# EAGLE design Carrier Board (EAGLE 8.4.0)

## Sheet 1 of 3: Sensors
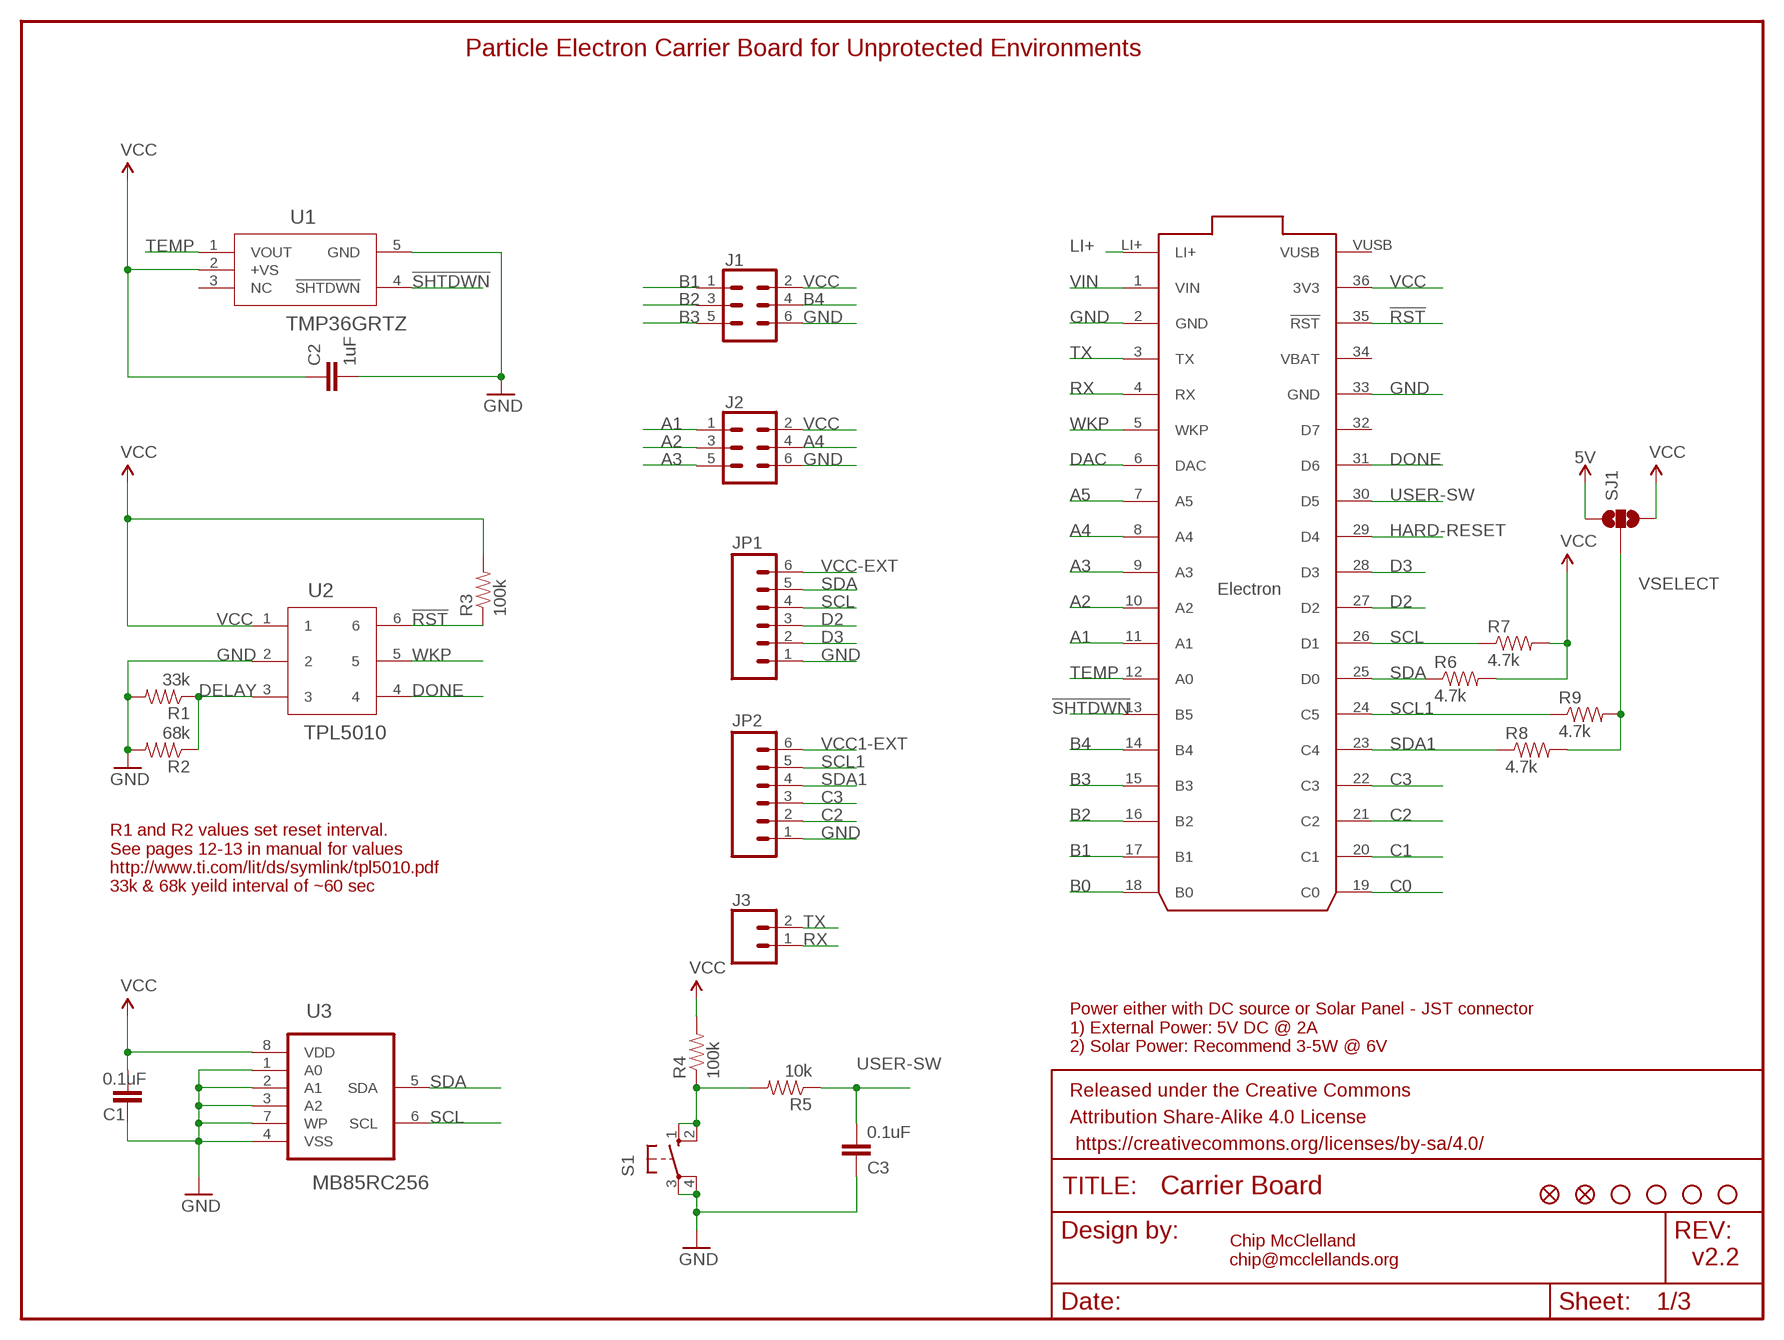
[diagram p0: schematic, sheet 1]

### Parts
C1  0.1uF  CAP0805  [0805]
C2  1uF  CAP0805  [0805]
C3  0.1uF  CAP0805  [0805]
FD1  FIDUCIALUFIDUCIAL  [FIDUCIAL-MICRO]
FD2  FIDUCIALUFIDUCIAL  [FIDUCIAL-MICRO]
FRAME1  FRAME-LETTER  [CREATIVE_COMMONS]
J1  CONN_03X22X3_SILK_MALE_PTH  [2X3]
J2  CONN_03X22X3_SILK_MALE_PTH  [2X3]
J3  CONN_02  [1X02]
JP1  M06LOCK  [1X06_LOCK]
JP2  M06LOCK  [1X06_LOCK]
JP3  STAND-OFF  [STAND-OFF]
JP4  STAND-OFF  [STAND-OFF]
JP5  STAND-OFF  [STAND-OFF]
JP6  STAND-OFF  [STAND-OFF]
R1  33k  RESISTOR0805-RES  [0805]
R2  68k  RESISTOR0805-RES  [0805]
R3  100k  RESISTOR0805-RES  [0805]
R4  100k  RESISTOR0805-RES  [0805]
R5  10k  RESISTOR0805-RES  [0805]
R6  4.7k  RESISTOR0805-RES  [0805]
R7  4.7k  RESISTOR0805-RES  [0805]
R8  4.7k  RESISTOR0805-RES  [0805]
R9  4.7k  RESISTOR0805-RES  [0805]
S1  10-XX  [B3F-10XX]
SJ1  SOLDERJUMPER_2WAYPASTE1&2  [SJ_3_PASTE1&2]
U1  TMP36GRTZ  TMP36GRTZ-REEL7  [RJ_5]
U2  TPL5010  [TSOT-23]
U3  MB85RC256  MB85RC128PNF-G-JNE1  [SOIC127P600X175-8N]
U4  Particle Electron  ELECTRON-PWR-PINS  [ELECTON-PWR-PINS]

### Nets
5V: SJ1.1 ; also sheet 3
!RST: R3.1 U2.6 U4.35(!RST)
!SHTDWN: U1.4(!SHTDWN) U4.13(B5)
A1: J2.1 U4.11(A1)
A2: J2.3 U4.10(A2)
A3: J2.5 U4.9(A3)
A4: J2.4 U4.8(A4)
A5: U4.7(A5)
B0: U4.18(B0)
B1: J1.1 U4.17(B1)
B2: J1.3 U4.16(B2)
B3: J1.5 U4.15(B3)
B4: J1.4 U4.14(B4)
C0: U4.19(C0)
C1: U4.20(C1)
C2: JP2.2 U4.21(C2) ; also sheet 3
C3: JP2.3 U4.22(C3) ; also sheet 3
D2: JP1.3 U4.27(D2) ; also sheet 3
D3: JP1.2 U4.28(D3) ; also sheet 3
DAC: U4.6(DAC)
DELAY: R1.1 R2.1 U2.3
DONE: U2.4 U4.31(D6)
GND: C1.2 C2.2 C3.2 J1.6 J2.6 JP1.1 JP2.1 R1.2 R2.2 S1.3(P) S1.4(P1) U1.5(GND) U2.2 U3.1(A0) U3.2(A1) U3.3(A2) U3.4(VSS) U3.7(WP) U4.2(GND) U4.33(GND) ; also sheet 2,3
HARD-RESET: U4.29(D4) ; also sheet 2
LI+: U4.LI+ ; also sheet 2
N$4: R4.1 R5.2 S1.1(S) S1.2(S1)
RX: J3.1 U4.4(RX)
SCL: JP1.4 R7.1 U3.6(SCL) U4.26(D1) ; also sheet 3
SCL1: JP2.5 R9.1 U4.24(C5) ; also sheet 3
SDA: JP1.5 R6.1 U3.5(SDA) U4.25(D0) ; also sheet 3
SDA1: JP2.4 R8.1 U4.23(C4) ; also sheet 3
TEMP: U1.1(VOUT) U4.12(A0)
TX: J3.2 U4.3(TX)
USER-SW: C3.1 R5.1 U4.30(D5)
VCC: C1.1 C2.1 J1.2 J2.2 R3.2 R4.2 R6.2 R7.2 SJ1.3 U1.2(+VS) U2.1 U3.8(VDD) U4.36(3V3) ; also sheet 3
VCC1-EXT: JP2.6 ; also sheet 3
VCC-EXT: JP1.6 ; also sheet 3
VIN: U4.1(VIN) ; also sheet 2
VSELECT: R8.2 R9.2 SJ1.2 ; also sheet 3
WKP: U2.5 U4.5(WKP)
Unconnected: U1.3(NC) U4.32(D7) U4.VUSB

### Notes on the sheet
- Particle Electron Carrier Board for Unprotected Environments
- R1 and R2 values set reset interval.
  See pages 12-13 in manual for values
  http://www.ti.com/lit/ds/symlink/tpl5010.pdf
  33k & 68k yeild interval of ~60 sec
- Power either with DC source or Solar Panel - JST connector
  1) External Power: 5V DC @ 2A 
  2) Solar Power: Recommend 3-5W @ 6V
- Chip McClelland
  chip@mcclellands.org
- v2.2

## Sheet 2 of 3: Power Control
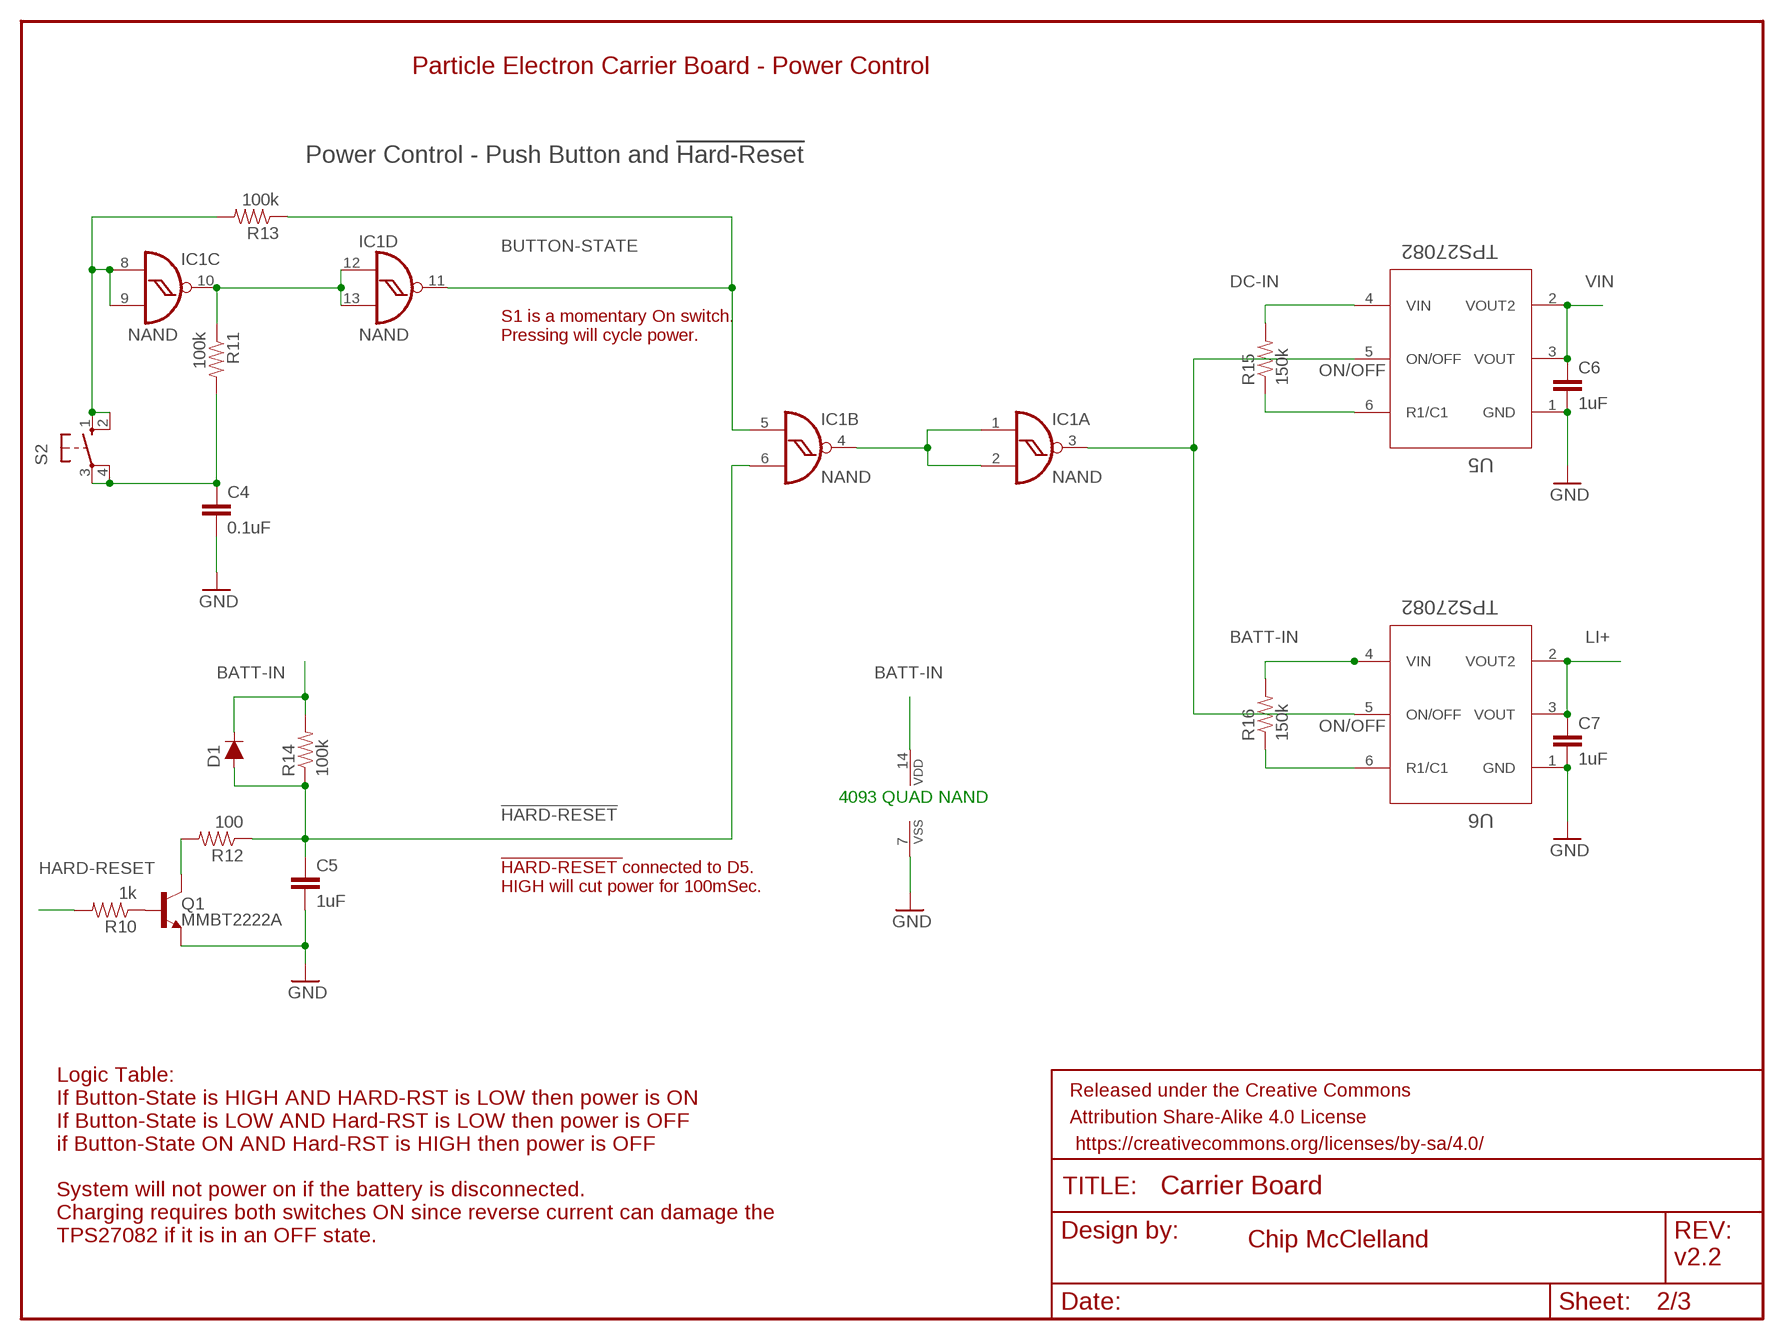
[diagram p1: schematic, sheet 2]

### Parts
C4  0.1uF  CAP0805  [0805]
C5  1uF  CAP0805  [0805]
C6  1uF  CAP0805  [0805]
C7  1uF  CAP0805  [0805]
D1  DIODE-BAS16J  [SOD-323]
FRAME2  FRAME-LETTER  [CREATIVE_COMMONS]
IC1  NAND  4093DT  [MC14093B-TSSOP14]
Q1  MMBT2222A  TRANS_NPN-MMBT2222AL  [SOT23-3]
R10  1k  RESISTOR0805-RES  [0805]
R11  100k  RESISTOR0805-RES  [0805]
R12  100  RESISTOR0805-RES  [0805]
R13  100k  RESISTOR0805-RES  [0805]
R14  100k  RESISTOR0805-RES  [0805]
R15  150k  RESISTOR0805-RES  [0805]
R16  150k  RESISTOR0805-RES  [0805]
S2  40-XX-ROUND  [B3F-40XX-ROUND]
U5  TPS27082  [TSOT-23]
U6  TPS27082  [TSOT-23]

### Nets
!HARD-RESET: C5.1 D1.A IC1.6(B:I1) R12.1 R14.1
BATT-IN: D1.C IC1.14(P:VDD) R14.2 R16.2 U6.4(VIN) ; also sheet 3
BUTTON-STATE: IC1.5(B:I0) IC1.11(D:O) R13.1
DC-IN: R15.2 U5.4(VIN) ; also sheet 3
GND: C4.2 C5.2 C6.2 C7.2 IC1.7(P:VSS) Q1.2(E) U5.1(GND) U6.1(GND) ; also sheet 1,3
HARD-RESET: R10.2 ; also sheet 1
LI+: C7.1 U6.2(VOUT2) U6.3(VOUT) ; also sheet 1
N$1: IC1.1(A:I0) IC1.2(A:I1) IC1.4(B:O)
N$14: IC1.10(C:O) IC1.12(D:I0) IC1.13(D:I1) R11.1
N$15: R15.1 U5.6(R1/C1)
N$16: Q1.1(B) R10.1
N$17: R16.1 U6.6(R1/C1)
N$19: Q1.3(C) R12.2
N$24: C4.1 R11.2 S2.3(P) S2.4(P1)
N$25: IC1.8(C:I0) IC1.9(C:I1) R13.2 S2.1(S) S2.2(S1)
ON/OFF: IC1.3(A:O) U5.5(ON/OFF) U6.5(ON/OFF)
VIN: C6.1 U5.2(VOUT2) U5.3(VOUT) ; also sheet 1

### Notes on the sheet
- Particle Electron Carrier Board - Power Control
- Power Control - Push Button and !Hard-Reset
- S1 is a momentary On switch.
  Pressing will cycle power.
- 4093 QUAD NAND
- !HARD-RESET !connected to D5. 
  HIGH will cut power for 100mSec.
- Chip McClelland
- Logic Table:
  If Button-State is HIGH AND HARD-RST is LOW then power is ON
  If Button-State is LOW AND Hard-RST is LOW then power is OFF
  if Button-State ON AND Hard-RST is HIGH then power is OFF
  
  System will not power on if the battery is disconnected.  
  Charging requires both switches ON since reverse current can damage the
  TPS27082 if it is in an OFF state.
- v2.2

## Sheet 3 of 3: Protection and 5V Boost
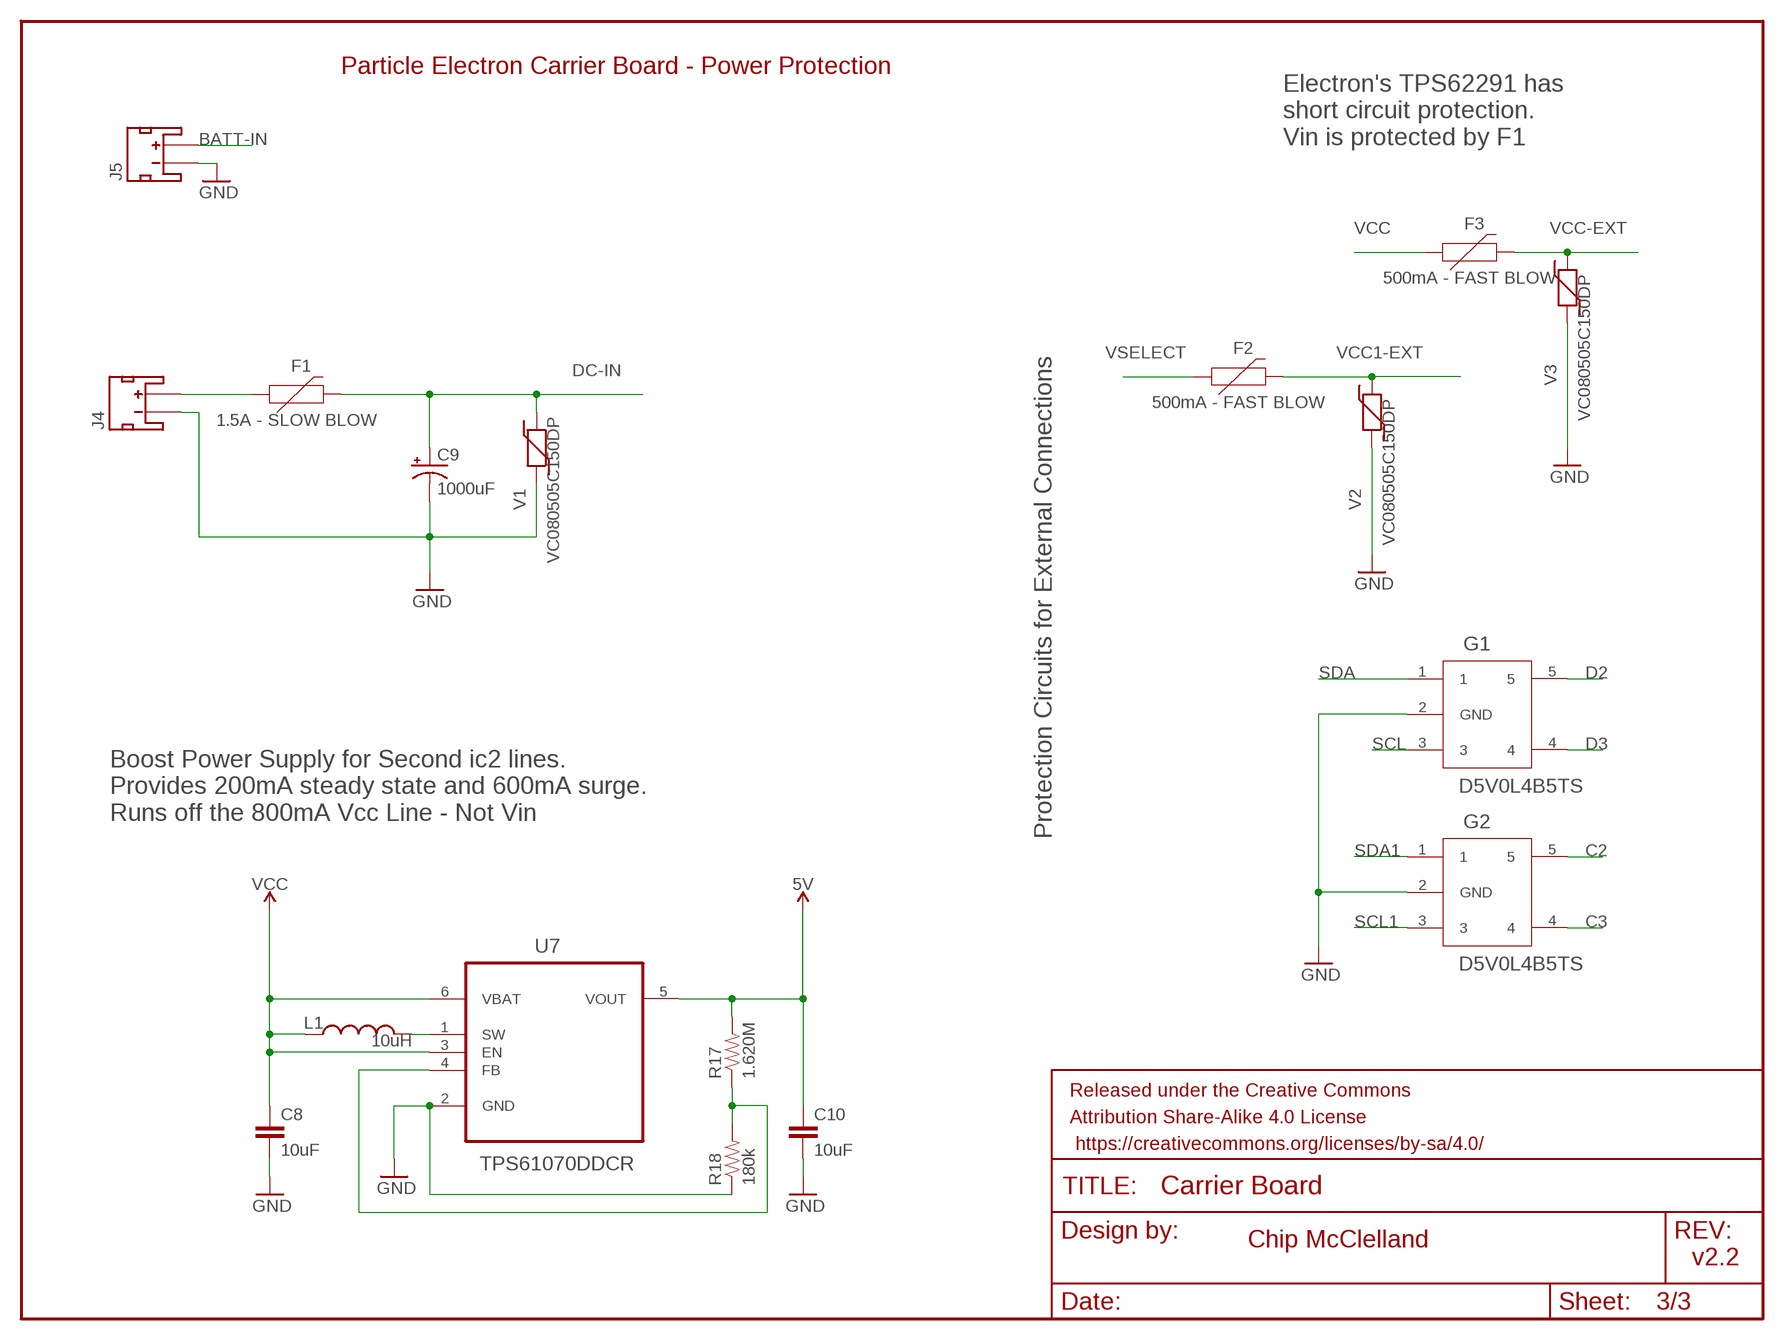
[diagram p2: schematic, sheet 3]

### Parts
C8  10uF  CAP0805  [0805]
C9  1000uF  CAP_POLG  [PANASONIC_G]
C10  10uF  CAP0805  [0805]
F1  1.5A - SLOW BLOW  PPTC_HALF-AMP  [1206]
F2  500mA - FAST BLOW  PPTC_HALF-AMP  [1206]
F3  500mA - FAST BLOW  PPTC_HALF-AMP  [1206]
FRAME3  FRAME-LETTER  [CREATIVE_COMMONS]
G1  D5V0L4B5TS  [SOT-23-5]
G2  D5V0L4B5TS  [SOT-23-5]
J4  5V @ 2A  JST_2MM_MALE  [JST-2-SMD]
J5  JST_2MM_MALE  [JST-2-SMD]
L1  10uH  INDUCTORSDR0403-560KL  [SDR0403]
R17  1.620M  RESISTOR0805-RES  [0805]
R18  180k  RESISTOR0805-RES  [0805]
U7  TPS61070DDCR  [SOT95P280X110-6N]
V1  VC080505C150DP  VARISTOR  [0805]
V2  VC080505C150DP  VARISTOR  [0805]
V3  VC080505C150DP  VARISTOR  [0805]

### Nets
5V: C10.1 R17.2 U7.5(VOUT) ; also sheet 1
BATT-IN: J5.2(+) ; also sheet 2
C2: G2.5 ; also sheet 1
C3: G2.4 ; also sheet 1
D2: G1.5 ; also sheet 1
D3: G1.4 ; also sheet 1
DC-IN: C9.+ F1.2 V1.2 ; also sheet 2
DC-IN-EXT: F1.1 J4.2(+)
GND: C8.2 C9.- C10.2 G1.2(GND) G2.2(GND) J4.1(-) J5.1(-) R18.1 U7.2(GND) V1.1 V2.1 V3.1 ; also sheet 1,2
N$2: R17.1 R18.2 U7.4(FB)
SCL: G1.3 ; also sheet 1
SCL1: G2.3 ; also sheet 1
SDA: G1.1 ; also sheet 1
SDA1: G2.1 ; also sheet 1
SW: L1.P$2 U7.1(SW)
VCC: C8.1 F3.1 L1.P$1 U7.3(EN) U7.6(VBAT) ; also sheet 1
VCC1-EXT: F2.2 V2.2 ; also sheet 1
VCC-EXT: F3.2 V3.2 ; also sheet 1
VSELECT: F2.1 ; also sheet 1
Unconnected: J4.NC1(PAD1) J4.NC2(PAD2) J5.NC1(PAD1) J5.NC2(PAD2)

### Notes on the sheet
- Particle Electron Carrier Board - Power Protection
- Electron's TPS62291 has 
  short circuit protection. 
  Vin is protected by F1
- Boost Power Supply for Second ic2 lines.
  Provides 200mA steady state and 600mA surge. 
  Runs off the 800mA Vcc Line - Not Vin
- Protection Circuits for External Connections
- Chip McClelland
- v2.2

## Power pins joined to a net without a drawn wire
VBAT: U4.34(VBAT)

## Library data of the parts
C1-C8 C10 = SparkFun-Capacitors:CAP: Capacitor Standard 0603 ceramic capacitor, and 0.1" leaded capacitor.
C9 = SparkFun-Capacitors:CAP_POL: Capacitor Polarized These are standard SMD and PTH capacitors. Normally 10uF, 47uF, and 100uF in electrolytic and tantalum varieties. Always verify the external diameter of the through hole cap, it varies with capacity, voltage, and manufacturer. The EIA devices should be standard.
D1 = SparkFun-DiscreteSemi:DIODE: Diode These are standard reverse protection diodes and small signal diodes. SparkFun Products: SparkFun SparkPunk Sound Kit <https://www.sparkfun.com/products/11177> SparkFun ESP8266 Thing <https://www.sparkfun.com/products/13231>; PROD_ID: DIO-09646; VALUE: 250mA/100V
F1-F3 = SparkFun-Fuses:PPTC: Resettable Fuse PPTC Resettable Fuse. Really a sort of resistor with a polymeric positive temperature coefficient whose resistance increases dramatically with an increase in temperature. When heated by the power passing through the resistance rises causing the current to be limited, protecting the circuit. This is achieved by the transition of the polymer from a crystalline to an amorphous state where the conductive carbon separates breaking the conductive pathways found in the cool crystalline structure. When a PPTC cools back down it resumes conducting letting the circuit turn back on. SparkFun Products: SparkFun RedBoard - Programmed with Arduino <https://www.sparkfun.com/products/12757> Pro Micro - 5V/16MHz <https://www.sparkfun.com/products/12640> Arduino Pro 328 - 5V/16MHz <https://www.sparkfun.com/products/10915> MP3 Trigger <https://www.sparkfun.com/products/13720>; PROD_ID: RES-08585; VALUE: 6V/0.5A
FD1 FD2 = SparkFun-Aesthetics:FIDUCIAL: Fiducial Alignment Points Point-of-reference for pick-and-place machines and other optical instruments.
FRAME1-FRAME3 = SparkFun-Aesthetics:FRAME-LETTER: Schematic Frame - Letter Standard 8.5x11 US Letter frame
G1 G2 = Custom Components:D5V0L4B5TS: 4 CHANNEL LOW CAPACITANCE BI-DIRECTIONAL TVS ARRAY
IC1 = adafruit:4093: Quad 2-input NAND schmitt trigger
J1 J2 = SparkFun-Connectors:CONN_03X2: Multi connection point. Often used as Generic Header-pin footprint for 0.1 inch spaced/style header connections You can populate with any combo of single row headers, but if you'd like an exact match, check these: Header - 2x3 (Male, 0.1") <https://www.sparkfun.com/products/12807> (PRT-12807) Header - 2x3 (Female, 0.1") <https://www.sparkfun.com/products/13010> (PRT-13010) 2x3 Pin Shrouded Header <https://www.sparkfun.com/products/10877> (PRT-10877) On any of the 0.1 inch spaced packages, you can populate with these: Break Away Headers - Straight <https://www.sparkfun.com/products/116> (PRT-00116) Break Away Male Headers - Right Angle <https://www.sparkfun.com/products/553> (PRT-00553) Female Headers <https://www.sparkfun.com/products/115> (PRT-00115) Break Away Headers - Machine Pin <https://www.sparkfun.com/products/117> (PRT-00117) Break Away Female Headers - Swiss Machine Pin <https://www.sparkfun.com/products/743> (PRT-00743) Special note: the shrouded connector mates well with our 3x2 ribbon cables: Ribbon Crimp Connector - 6-pin (2x3, Female) <https://www.sparkfun.com/products/10651> (PRT-10651) Ribbon Cable - 6 wire (15ft) <https://www.sparkfun.com/products/10646> (PRT-10646); PROD_ID: CONN-09701
J3 = SparkFun-Connectors:CONN_02: Multi connection point. Often used as Generic Header-pin footprint for 0.1 inch spaced/style header connections On any of the 0.1 inch spaced packages, you can populate with these: Break Away Headers - Straight <https://www.sparkfun.com/products/116> (PRT-00116) Break Away Male Headers - Right Angle <https://www.sparkfun.com/products/553> (PRT-00553) Female Headers <https://www.sparkfun.com/products/115> (PRT-00115) Break Away Headers - Machine Pin <https://www.sparkfun.com/products/117> (PRT-00117) Break Away Female Headers - Swiss Machine Pin <https://www.sparkfun.com/products/743> (PRT-00743) For SCREWTERMINALS and SPRING TERMINALS visit here: Screw Terimnals on SparkFun.com <https://www.sparkfun.com/search/results?term=Screw+Terminals> (5mm/3.5mm/2.54mm spacing) This device is also useful as a general connection point to wire up your design to another part of your project. Our various solder wires solder well into these plated through hole pads. Hook-Up Wire - Assortment (Stranded, 22 AWG) <https://www.sparkfun.com/products/11375> (PRT-11375) Hook-Up Wire - Assortment (Solid Core, 22 AWG) <https://www.sparkfun.com/products/11367> (PRT-11367) View the entire wire category on our website here <https://www.sparkfun.com/categories/141> Special notes: Molex polarized connector foot print use with: PRT-08233 with associated crimp pins and housings. 2.54_SCREWTERM for use with PRT-10571. 3.5mm Screw Terminal footprints for PRT-08084 5mm Screw Terminal footprints for use with PRT-08432
J4 J5 = SparkFun-Connectors:JST_2MM_MALE: JST 2MM MALE RA CONNECTOR Two pin, compact surface mount connector. Commonly used as a battery input connection point. We really like the solid locking feeling and high current rating on these small connectors. We use these all the time as battery connectors. Mates to single-cell LiPo batteries. Here is the connector we sell at SparkFun: JST Right Angle Connector - White <https://www.sparkfun.com/products/8612> (PRT-08612) Datasheet <http://www.sparkfun.com/datasheets/Prototyping/Connectors/JST-Horizontal.pdf> It was used on these SparkFun products: SparkFun MOSFET Power Controller <https://www.sparkfun.com/products/11214> (PRT-11214) SparkFun Battery Babysitter - LiPo Battery Manager <https://www.sparkfun.com/products/13777> (PRT-13777) And many, many others that required a lipo battery connection.; PROD_ID: CONN-11443; SF_ID: PRT-08612
JP1 JP2 = SparkFun-Connectors:M06: Header 6 Standard 6-pin 0.1" header. Use with straight break away headers (SKU : PRT-00116), right angle break away headers (PRT-00553), swiss pins (PRT-00743), machine pins (PRT-00117), and female headers (PRT-00115). Molex polarized connector foot print use with SKU : PRT-08094 with associated crimp pins and housings. NOTES ON THE VARIANTS LOCK and LOCK_LONGPADS... This footprint was designed to help hold the alignment of a through-hole component (i.e. 6-pin header) while soldering it into place. You may notice that each hole has been shifted either up or down by 0.005 of an inch from it's more standard position (which is a perfectly straight line). This slight alteration caused the pins (the squares in the middle) to touch the edges of the holes. Because they are alternating, it causes a "brace" to hold the component in place. 0.005 has proven to be the perfect amount of "off-center" position when using our standard breakaway headers. Although looks a little odd when you look at the bare footprint, once you have a header in there, the alteration is very hard to notice. Also,if you push a header all the way into place, it is covered up entirely on the bottom side. This idea of altering the position of holes to aid alignment will be further integrated into the Sparkfun Library for other footprints. It can help hold any component with 3 or more connection pins.
JP3-JP6 = SparkFun:STAND-OFF: Stand Off This is the mechanical footprint for a #4 phillips button head screw. Use the keepout ring to avoid running the screw head into surrounding components. SKU : PRT-00447
L1 = SparkFun-Passives:INDUCTOR: Inductors Basic Inductor/Choke - 0603 and 1206. Footprints are not proven and vary greatly between part numbers. SRN6045- 33uH, 20% 1.4A SDR0403-560KL - 56uH, 10%, 500mA RMS/740mA peak; DIST: DIGIKEY; DIST_ID: SDR0403-560KLCT-ND; VALUE: 56uH
Q1 = SparkFun-DiscreteSemi:TRANS_NPN: NPN transistor Current controlled devices typically used to amplify current or used as a switch. BC547 - COM-08928 <http://www.sparkfun.com/products/8928> (TO-92 45V 100mA) (1.Collector 2.Base 3.Emitter) 2N3904 - COM-00521 <http://www.sparkfun.com/products/521> (TO-92 40V 200mA) (1.Emitter 2.Base 3.Collector) P2N2222A - COM-12852 <http://www.sparkfun.com/products/12852> (TO-92 40V 600mA) (1.Collector 2.Base 3.Emitter); PROD_ID: TRANS-08049; VALUE: 600mA/40V
R1-R18 = SparkFun-Passives:RESISTOR: Resistor Basic schematic elements and footprints for 0603, 1206, and PTH resistors.
S1 = switch-omron:10-XX: OMRON SWITCH
S2 = adafruit:40-XX: OMRON SWITCH
SJ1 = SparkFun-Passives:SOLDERJUMPER_2WAY: Solder Jumper 2 way solder jumper
U1 = TMP36:TMP36GRTZ-REEL7; MANUFACTURER_PART_NUMBER: TMP36GRTZREEL7; VENDOR: Analog Devices Inc
U2 = Custom Components:TPL5010
U3 = Fujitsu_By_element14_Batch_1:MB85RC128PNF-G-JNE1: Memory FRAM; MPN: MB85RC128PNF-G-JNE1; OC_FARNELL: 1831995; OC_NEWARK: 93R5161; PACKAGE: SO-8; SUPPLIER: FUJITSU
U4 = Particle-Devices:ELECTRON-PWR-PINS: This is a Electron pinout with the two power pins populated
U5 U6 = Custom Components:TPS27082: TI TPS27082 Single High-Side On-Off Switch
U7 = Texas Instruments_By_element14_Batch_1:TPS61070DDCR: SYNCHRONOUS BOOST CONVERTER; MPN: TPS61070DDCR; OC_FARNELL: 1461062; OC_NEWARK: 64M3125; PACKAGE: SOT-23-6; SUPPLIER: Texas Instruments
V1-V3 = Custom Components:VARISTOR

## Net classes
0 default: width 0.203 mm, drill 0.33 mm

## Board
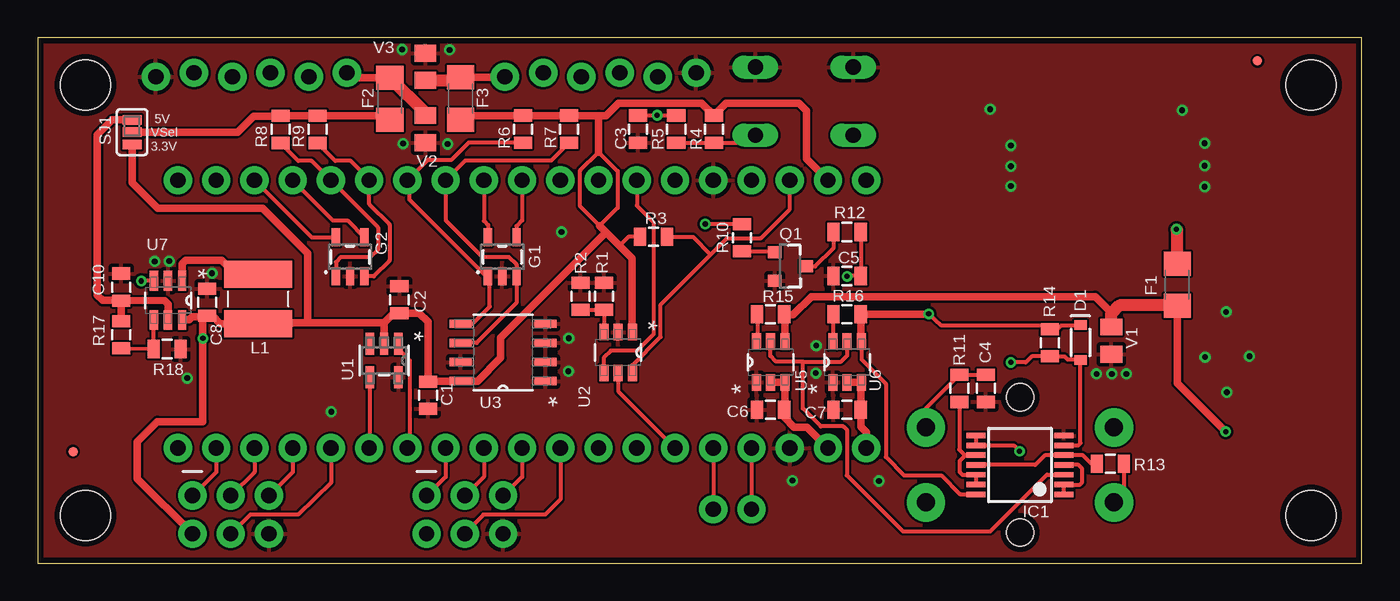
[diagram p3: board, top side]
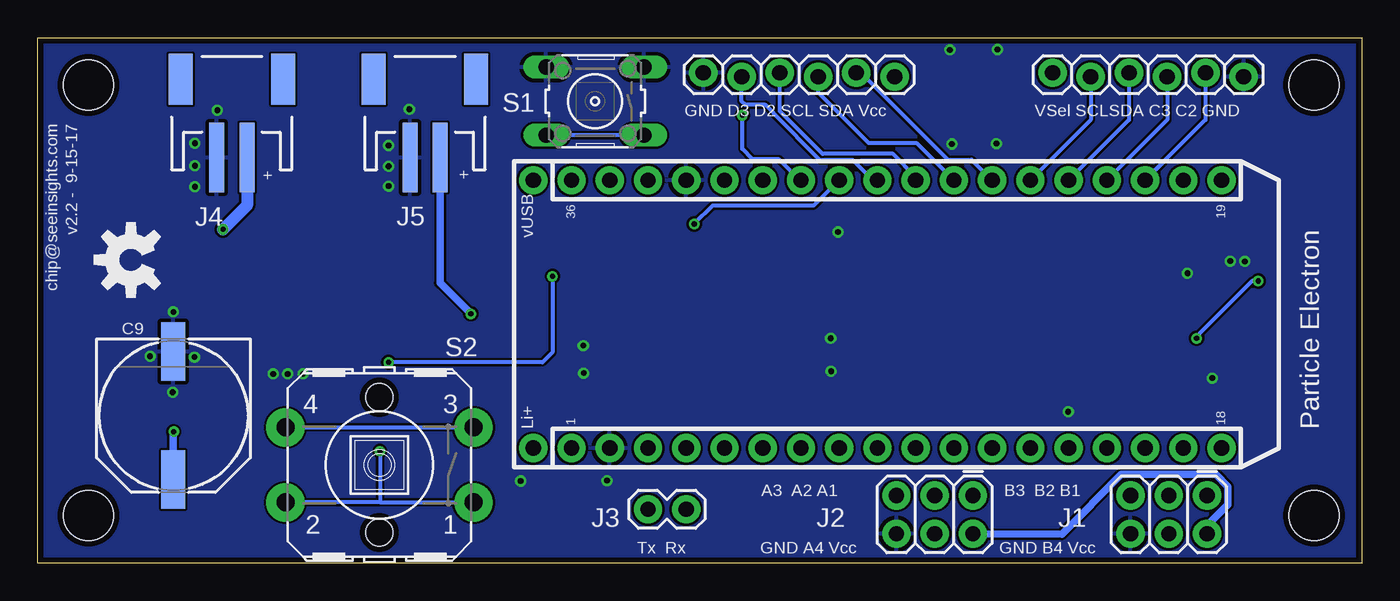
[diagram p4: board, bottom side, seen from below]

Size 87.96 x 34.9 mm. Coordinates in mm from the lower left corner, seen from the top.
Outline: 0,0 87.96,0 87.96,34.9 0,34.9 0,0
Copper layers (1*16): Top 0.0356mm / dielectric 1.5011mm / Bottom 0.0356mm
Design rules "LaenPCBOrder": minimum track width 6mil, minimum drill 13mil, track to track 6mil, track to pad 6mil, pad to pad 6mil, via to via 6mil, smd to smd 6mil, copper to edge 15mil, drill to drill 6mil, minimum pad ring 7mil, minimum via ring 7mil, stop-mask expansion 3mil, vias tented up to drill 0mil, thermal gap 10mil

### Footprints (pad centres in the part's own frame; a part is rotated, then mirrored left to right if it is on the bottom)
0805 = smd 0.8 x 1.2: 1 -0.9,0; 2 0.9,0
PANASONIC_G = smd 3.9 x 1.6: + 4.25,0; - -4.25,0
SOD-323 = smd 0.63 x 0.83: A 1.15,0; C -1.15,0
1206 = smd 1.6 x 1.8: 1 -1.4,0; 2 1.4,0
FIDUCIAL-MICRO = smd 0.635 x 0.635: 1 0,0
SOT-23-5 = smd 0.55 x 1.2: 1 -0.95,-1.3; 2 0,-1.3; 3 0.95,-1.3; 4 0.95,1.3; 5 -0.95,1.3
MC14093B-TSSOP14 = smd 0.36 x 1.26: 1 -1.95,-2.925; 2 -1.3,-2.925; 3 -0.65,-2.925; 4 0,-2.925; 5 0.65,-2.925; 6 1.3,-2.925; 7 1.95,-2.925; 8 1.95,2.925; 9 1.3,2.925; 10 0.65,2.925; 11 0,2.925; 12 -0.65,2.925; 13 -1.3,2.925; 14 -1.95,2.925
2X3 = drill 1.016 pad 1.88: 1 0,0; 2 0,2.54; 3 2.54,0; 4 2.54,2.54; 5 5.08,0; 6 5.08,2.54
1X02 = drill 1.016 pad 1.88: 1 0,0; 2 2.54,0
JST-2-SMD = smd 1 x 4.6: 1 -1,-3.7; 2 1,-3.7 | smd 1.6 x 3.4: NC1 -3.4,1.5; NC2 3.4,1.5
1X06_LOCK = drill 1.016 pad 1.88: 1 0,0; 2 2.54,-0.254; 3 5.08,0; 4 7.62,-0.254; 5 10.16,0; 6 12.7,-0.254
STAND-OFF = hole 3.302: 0,0
SDR0403 = smd 1.8 x 4.5: P$1 -1.65,0; P$2 1.65,0
SOT23-3 = smd 0.8 x 0.9: 1 -0.95,-1; 2 0.95,-1; 3 0,1.1
B3F-10XX = drill 1.016 long: 1 -3.251,2.261; 2 3.251,2.261; 3 -3.251,-2.261; 4 3.251,-2.261
B3F-40XX-ROUND = drill 1.194 pad 2.54: 1 -6.248,2.489; 2 6.248,2.489; 3 -6.248,-2.489; 4 6.248,-2.489 | hole 1.803: 0,-4.496; 0,4.496
SJ_3_PASTE1&2 = smd 0.635 x 1.27: 1 -0.813,0; 2 0,0; 3 0.813,0
RJ_5 = smd 1.473 x 0.559: 1 -1.118,0.95; 2 -1.118,0; 3 -1.118,-0.95; 4 1.118,-0.95; 5 1.118,0.95
TSOT-23 = smd 1.1 x 0.6: 1 -1.35,0.95; 2 -1.35,0; 3 -1.35,-0.94; 4 1.35,-0.95; 5 1.35,0; 6 1.35,0.95
SOIC127P600X175-8N = smd 1.473 x 0.559: 1 -2.819,1.905; 2 -2.819,0.635; 3 -2.819,-0.635; 4 -2.819,-1.905; 5 2.819,-1.905; 6 2.819,-0.635; 7 2.819,0.635; 8 2.819,1.905
ELECTON-PWR-PINS = drill 1.016 pad 1.88: 1 2.54,46.99; 2 2.54,44.45; 3 2.54,41.91; 4 2.54,39.37; 5 2.54,36.83; 6 2.54,34.29; 7 2.54,31.75; 8 2.54,29.21; 9 2.54,26.67; 10 2.54,24.13; 11 2.54,21.59; 12 2.54,19.05; 13 2.54,16.51; 14 2.54,13.97; 15 2.54,11.43; 16 2.54,8.89; 17 2.54,6.35; 18 2.54,3.81; 19 20.32,3.81; 20 20.32,6.35; 21 20.32,8.89; 22 20.32,11.43; 23 20.32,13.97; 24 20.32,16.51; 25 20.32,19.05; 26 20.32,21.59; 27 20.32,24.13; 28 20.32,26.67; 29 20.32,29.21; 30 20.32,31.75; 31 20.32,34.29; 32 20.32,36.83; 33 20.32,39.37; 34 20.32,41.91; 35 20.32,44.45; 36 20.32,46.99; LI+ 2.54,49.53; VUSB 20.32,49.53
SOT95P280X110-6N = smd 1.321 x 0.559: 1 -1.295,0.94; 2 -1.295,0; 3 -1.295,-0.94; 4 1.295,-0.94; 5 1.295,0; 6 1.295,0.94
0805' = smd 1.118 x 1.448: 1 -0.902,0; 2 0.902,0

### Placement (x,y rotation side)
C1  25.93,11.15 270 top
C2  24.03,17.5 90 top
C3  39.88,28.83 270 top
C4  62.99,11.61 270 top
C5  53.77,19.08 180 top
C6  48.69,10.19 180 top
C7  53.77,10.19 180 top
C8  11.25,17.32 90 top
C9  78.94,9.8 270 bottom
C10  5.56,18.34 90 top
D1  69.27,14.66 270 top
F1  75.69,18.49 270 top
F2  23.39,30.84 90 top
F3  28.09,30.86 90 top
FD1  81.03,33.35 0 top
FD2  2.36,7.42 0 top
FRAME1  0.03,-11.81 0 top  (outside the outline)
FRAME2  0.03,-20.29 0 top  (outside the outline)
FRAME3  0.03,-28.78 0 top  (outside the outline)
G1  30.86,20.35 0 top
G2  20.75,20.35 0 top
IC1  65.25,6.53 90 top
J1  10.29,4.5 180 bottom
J2  25.83,4.5 180 bottom
J3  44.88,3.58 180 bottom
J4  75.06,30.63 0 bottom
J5  62.23,30.63 0 bottom
JP1  43.74,32.56 0 bottom
JP2  7.85,32.31 180 bottom
JP3  84.58,31.75 0 top
JP4  84.58,3.17 90 top
JP5  3.17,31.75 0 top
JP6  3.17,3.17 0 top
L1  14.66,17.55 90 top
Q1  49.96,19.71 270 top
R1  37.62,17.73 90 top
R2  36.07,17.73 90 top
R3  40.92,21.67 180 top
R4  44.93,28.83 90 top
R5  42.42,28.83 270 top
R6  32.26,28.83 90 top
R7  35.31,28.83 90 top
R8  16.13,28.8 90 top
R9  18.59,28.8 90 top
R10  46.79,21.62 90 top
R11  61.21,11.61 90 top
R12  53.77,22 180 top
R13  71.25,6.6 0 top
R14  67.23,14.63 90 top
R15  48.69,16.54 0 top
R16  53.77,16.54 0 top
R17  5.56,15.16 90 top
R18  8.61,14.22 180 top
S1  50.93,30.68 180 bottom
S2  65.25,6.53 180 bottom
SJ1  6.27,28.63 270 top
U1  23.01,13.46 270 top
U2  38.56,14 270 top
U3  30.91,14 180 top
U4  5.51,5.11 90 bottom
U5  48.69,13.36 90 top
U6  53.77,13.36 90 top
U7  8.66,17.45 270 top
U$2  [OSHW-LOGO-M]  81.76,20.14 90 bottom
V1  VC080505C150DP  [0805']  71.32,14.78 90 top
V2  VC080505C150DP  [0805']  25.76,28.83 90 top
V3  VC080505C150DP  [0805']  25.76,32.97 270 top

### Tracks (layer width: path | path; a pad name or v marks a point on that pad's centre or on a via)
5V
  Top 0.508: U7.5 8.66,17.2 8.43,17.42 5.57,17.45 | 5.57,17.45 C10.1 R17.2 | SJ1.1 4.95,29.44 3.96,28.45 3.96,17.8 4.32,17.45 5.55,17.48 5.57,17.45
!HARD-RESET  (via drill 0.33)
  Top 0.254: R12.1 C5.1 53.77,19.07 v53.77,19.05 | v64.64,13.34 65.63,13.34 66.03,13.73 R14.1 | 67.22,13.72 R14.1 | R14.1 68.21,13.73 68.43,13.51 D1.A 69.27,7.98 69.12,7.83 IC1.6
  Bottom 0.254: v53.77,19.05 53.77,14 54.43,13.34 v64.64,13.34
!RST
  Top 0.254: U4.35 49.96,23.52 48.03,21.59 45.8,21.59 44.7,20.49 | U2.6 39.51,13.16 41.38,15.03 41.38,17.17 44.7,20.49 | R3.1 43.52,21.67 44.7,20.49
!SHTDWN
  Top 0.254: U1.4 22.06,7.69 U4.13
A1
  Top 0.254: U4.11 27.1,5.74 J2.1
A2
  Top 0.254: U4.10 29.64,5.74 J2.3
A3
  Top 0.254: U4.9 32.18,5.74 J2.5
A4
  Top 0.254: U4.8 34.72,4.24 33.71,3.23 29.62,3.23 J2.4
B1
  Top 0.254: U4.17 11.86,6.04 J1.1
B2
  Top 0.254: U4.16 14.4,6.04 J1.3
B3
  Top 0.254: U4.15 16.94,6.04 J1.5
B4
  Top 0.254: U4.14 19.48,5.36 17.3,3.23 14.12,3.23 J1.4
BATT-IN  (via drill 0.35)
  Top 0.254: U6.4 54.66,14.78 | 59.21,16.54 59.99,15.81 66.96,15.81 R14.2 67.73,15.53 68,15.8 69.26,15.8 D1.C | 54.67,14.76 54.74,14.7 54.74,13.51 56.34,11.91 56.34,7.06 57.56,5.84 60.02,5.84 61.27,4.6 62.31,4.6 IC1.14
  Top 0.508: U6.4 54.67,14.76 R16.2 59.21,16.54 v59.18,16.56
  Bottom 0.508: J5.2 61.23,18.61 v59.18,16.56
BUTTON-STATE
  Top 0.254: IC1.11 66.27,6.53 66.9,7.16 68.16,7.16 | 68.16,7.16 IC1.5 | R13.1 70,6.6 69.44,7.16 68.16,7.16
C2
  Top 0.254: 19.68,21.87 G2.5 18.21,21.64 14.43,25.43 U4.21
  Bottom 0.254: 14.3,25.53 13.13,26.7 | 14.3,25.53 U4.21 | JP2.2 10.39,29.44 14.3,25.53
C3
  Top 0.254: 21.7,21.96 G2.4 20.59,22.76 19.61,22.76 U4.22
  Bottom 0.254: 16.68,25.69 15.7,26.67 | 16.68,25.69 U4.22 | JP2.3 12.93,29.44 16.68,25.69
D2
  Top 0.254: U4.27 29.64,22.73 29.92,22.45 G1.5
  Bottom 0.254: 29.67,25.43 U4.27 29.64,25.68 31.14,27.18 35.81,27.18 38.66,30.02 JP1.3
D3
  Top 0.254: U4.28 32.18,22.76 31.8,22.38 G1.4
  Bottom 0.254: U4.28 32.46,25.43 33.81,26.77 35.98,26.77 39.06,29.85 39.06,29.87 39.62,30.43 40.95,30.43 41.2,30.68 JP1.2
DC-IN  (via drill 0.35)
  Top 0.254: 49.63,14.78 U5.4 | 49.63,16.38 R15.2
  Top 0.508: U5.4 49.64,16.48 | 49.64,16.48 R15.2 | 49.64,16.48 50.17,16.48 51.38,17.7 70.26,17.7 71.35,16.61 | F1.2 75.69,11.96 v78.92,8.74 78.94,8.71
  Top 0.813: F1.2 75.66,17.12 71.86,17.12 71.35,16.61 71.3,16.56 71.3,15.71 V1.2
  Bottom 0.508: C9.+ 78.94,8.71 v78.92,8.74
DC-IN-EXT  (via drill 0.35)
  Top 0.813: F1.1 75.69,22.12 v75.64,22.17
  Bottom 0.813: J4.2 74.06,23.76 v75.64,22.17 | v75.64,22.17 75.67,22.15 v75.64,22.17
DELAY
  Top 0.254: U2.3 R1.1 R2.1
DONE
  Top 0.254: U4.31 39.8,23.75 40.92,22.63 40.92,15.21 39.83,14.12 38.08,14.12 37.59,13.64 37.59,12.66 U2.4
GND  (via drill 0.38)
  other vias: 19.51,10.06 35.28,14.94 35.26,12.75 51.69,12.62 64.64,27.74 63.27,30.15 64.64,26.37 64.64,25.04 76.02,30.07 77.52,27.89 77.52,26.39 77.52,24.99 34.8,22 55.88,5.46 78.94,16.69 78.99,11.35 80.49,13.74 77.55,13.69 51.71,14.45 27.36,34.09 24.28,27.86 27.23,27.84 72.31,12.57 70.33,12.57 71.35,12.57 50.14,5.49 11.58,19.25 9.93,12.29 8.74,20.07 7.77,20.04 24.21,34.11
  pour Top (rank 2): -3.78,37.29 90.42,37.47 90.37,-2.01 -3.78,-2.18
  pour Bottom: -4.39,38.3 91.31,38.15 91.14,-2.41 -4.22,-2.39
HARD-RESET  (via drill 0.35)
  Top 0.254: v44.35,22.53 46.77,22.53 R10.2
  Bottom 0.254: U4.29 34.75,25.43 36.42,23.75 43.13,23.75 v44.35,22.53
LI+
  Top 0.254: U6.2 53.98,12.04 | 54.66,12.04 U6.3 54.66,11.81 | 54.66,10.21 C7.1
  Top 0.508: U4.LI+ 55.04,8.71 54.69,9.07 54.69,10.19 54.66,10.21 | C7.1 54.67,11.97 U6.3 U6.2
N$1
  Top 0.254: IC1.1 IC1.2 69.24,5.23 69.39,5.38 69.39,6.27 69.14,6.53 IC1.4
N$2
  Top 0.254: R17.1 7.7,14.24 R18.2 U7.4
N$4
  Top 0.254: S1.1 47.18,27.93 R4.1 R5.2
  Bottom 0.254: S1.1 S1.2
N$14
  Top 0.254: 62.35,5.21 IC1.13 IC1.12 62.32,5.87 61.44,5.87 61.24,6.07 61.24,6.78 61.63,7.18 IC1.10 62.32,7.19 61.57,7.19 61.21,7.54 R11.1
N$15
  Top 0.254: U5.6 47.8,14.78 47.8,16.38 R15.1
N$16
  Top 0.254: Q1.1 48.95,20.73 46.89,20.73 R10.1
N$17
  Top 0.254: U6.6 52.83,14.78 52.83,16.38 R16.1
N$19
  Top 0.254: 51.23,19.81 Q1.3 51.64,19.71 52.88,20.95 52.88,21.98 R12.2
N$24
  Top 0.254: S2.3 59,10.3 R11.2 C4.1
  Bottom 0.254: S2.4 S2.3
N$25  (via drill 0.33)
  Top 0.254: IC1.8 IC1.9 64.84,7.83 v65.23,7.44 65.28,7.39 | R13.2 72.15,4.68 S2.2
  Bottom 0.254: 65.18,4.04 S2.2 | 65.18,4.04 S2.1 | v65.23,7.44 65.23,4.08 65.18,4.04
ON/OFF
  Top 0.254: IC1.3 67.04,5.88 63.27,2.11 57.48,2.11 53.75,5.84 53.75,8.87 53.52,9.09 52.02,9.09 50.83,10.29 50.83,13.39 | U6.5 53.77,13.79 53.37,13.39 50.83,13.39 | 50.83,13.39 49.05,13.39 48.67,13.77 48.67,14.69 U5.5 | 50.83,13.39
RX
  Top 0.254: U4.4 J3.1
SCL
  Top 0.254: U3.6 29.16,14.63 31.81,17.28 G1.3 31.8,18.9 31.8,19.84 31.29,20.34 29.52,20.34 27.1,22.76 U4.26 28.42,26.75 34.12,26.75 R7.1
  Bottom 0.254: JP1.4 36.12,31.27 32.77,27.91 29.59,27.91 U4.26
SCL1
  Top 0.254: 21.74,19.13 G2.3 22.33,19.05 23.37,20.09 23.37,22.5 22.02,23.85 U4.24 22.02,25.5 20.8,26.72 19.78,26.72 R9.1
  Bottom 0.254: JP2.5 18.01,29.44 U4.24
SDA
  Top 0.254: U3.5 28.88,15.9 30.02,17.04 30.02,18.93 G1.1 29.8,19.05 24.69,24.16 24.69,25.3 U4.25 25.94,26.81 25.95,26.8 27.51,26.8 28.65,27.94 32.25,27.94 R6.1
  Bottom 0.254: JP1.5 33.27,32.56 27.51,26.8 25.93,26.8 U4.25
SDA1
  Top 0.254: G2.1 19.81,19.05 19.81,19.99 20.14,20.32 22.1,20.32 22.61,20.83 22.61,22.3 U4.23 18.19,26.72 17.31,26.72 R8.1
  Bottom 0.254: JP2.4 15.47,29.44 U4.23
SW
  Top 0.508: 13.14,19.2 L1.P$2 | 13.14,19.2 12.9,19.2 | 13.14,19.2 12.22,20.12 9.83,20.12 9.6,19.89 U7.1
TEMP
  Top 0.254: U1.1 23.96,14.21 24.71,13.46 24.71,7.8 U4.12
TX
  Top 0.254: U4.3 J3.2
USER-SW  (via drill 0.35)
  Top 0.254: R5.1 C3.1 | R5.1 42.15,29.73 | v41.15,29.74 42.4,29.74 R5.1
  Bottom 0.254: U4.30 37.31,25.43 38.71,26.82 40.46,26.82 41.15,27.51 v41.15,29.74
VCC  (via drill 0.35)
  Top 0.254: 27.91,12.04 U3.8 | 37.24,22.5 36.04,23.7 36.04,26.09 37.26,27.3 38.53,26.04 38.53,23.6 37.34,22.4 | R3.2 39.24,21.67 38.66,21.09 | U7.3 v6.88,18.75 6.81,18.75
  Top 0.508: U4.36 51.08,26.85 51.08,30.05 50.57,30.56 45.72,30.56 44.91,29.75 | 37.28,29.72 R7.2 R6.2 28.34,29.72 F3.1 28.26,29.7 | 37.76,21.98 37.34,22.4 | 37.76,21.98 38.66,21.09 39.5,20.24 39.5,15.36 U2.1 | 37.26,27.3 37.26,29.48 37.28,29.72 | 37.76,21.98 30.76,14.98 30.76,13.64 29.21,12.09 U3.8 25.97,12.09 C1.1 25.93,16.03 25.35,16.61 24.04,16.61 C2.1 23.64,16.6 23.01,15.98 | J1.2 6.63,5.61 6.63,8.08 7.95,9.4 10.97,9.4 v10.97,14.93 10.97,16.14 C8.1 | U1.2 23,14.59 23.01,14.61 23.01,15.98 | 17.95,15.98 23.01,15.98 | 16.9,15.98 17.95,15.98 | 16.9,15.98 16.46,15.98 16.41,16.03 | SJ1.3 6.27,25.27 7.98,23.57 14.96,23.57 17.93,20.6 17.93,16 17.95,15.98 | U7.6 10.06,16.15 10.26,16.36 11.19,16.36 C8.1 | C8.1 11.62,16.42 12.14,15.9 L1.P$1 16.82,15.9 16.9,15.98 | 37.28,29.72 37.74,29.72 38.58,30.56 44.1,30.56 44.91,29.75 | 44.91,29.75 R4.2
  Bottom 0.254: v6.88,18.75 7.29,18.75 11,15.04 11,14.96 v10.97,14.93
  Bottom 0.508: J2.2 19.91,1.93 15.98,5.89 9.7,5.89 8.89,5.07 8.89,3.89 10.29,2.5 J1.2
VCC1-EXT
  Top 0.508: F2.2 20.88,32.24 JP2.6
  Top 0.813: V2.2 25.76,29.87 F2.2
VCC-EXT
  Top 0.508: F3.2 30.99,32.26 JP1.6
  Top 0.813: V3.2 27.9,32.07 F3.2
VIN
  Top 0.254: 48.72,12.04 U5.2 | 49.63,12.04 U5.3 | 49.63,10.21 C6.1
  Top 0.508: C6.1 49.59,9.69 50.24,9.04 51.1,9.04 U4.1 | 49.63,10.21 U5.3 U5.2
VSELECT
  Top 0.508: SJ1.2 13.28,28.63 14.35,29.69 16.12,29.69 R8.2 R9.2 23.25,29.7 F2.1
WKP
  Top 0.254: U2.5 38.56,11.43 U4.5

### Text on the board
tNames: 5V / VSel / 3.3V
bNames: VSel SCLSDA C3 C2 GND | GND D3 D2 SCL SDA Vcc | v2.2 - 9-15-17 | chip@seeinsights.com | + | + | B3 B2 B1 | A3 A2 A1 | GND B4 Vcc | GND A4 Vcc | Tx Rx